# Altium schematic sheet 74ls08.SchDoc
size A4
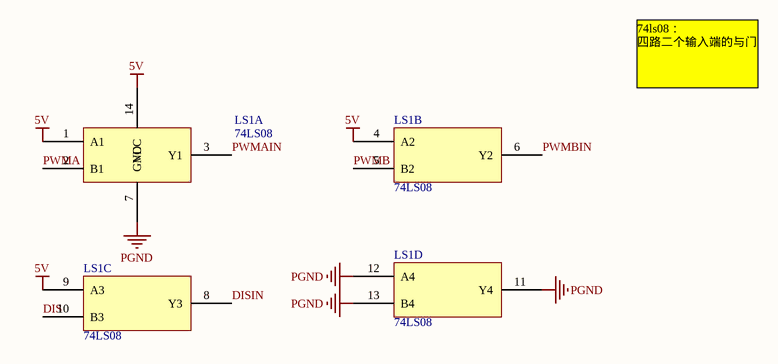
[diagram p0: 74ls08.SchDoc]

## Parts
LS1  74LS08  [SOP14]  (parts A,B,C,D of 4)

## Nets
5V: LS1.1(A1) LS1.4(A2) LS1.9(A3) LS1.14(VCC)
PGND: LS1.7(GND) LS1.11(Y4) LS1.12(A4) LS1.13(B4)
DIS: LS1.10(B3)
DISIN: LS1.8(Y3)
PWMA: LS1.2(B1)
PWMAIN: LS1.3(Y1)
PWMB: LS1.5(B2)
PWMBIN: LS1.6(Y2)

## Notes on the sheet
- 74ls08：
  四路二个输入端的与门